# EAGLE design openmotestm (EAGLE 6.6.0)
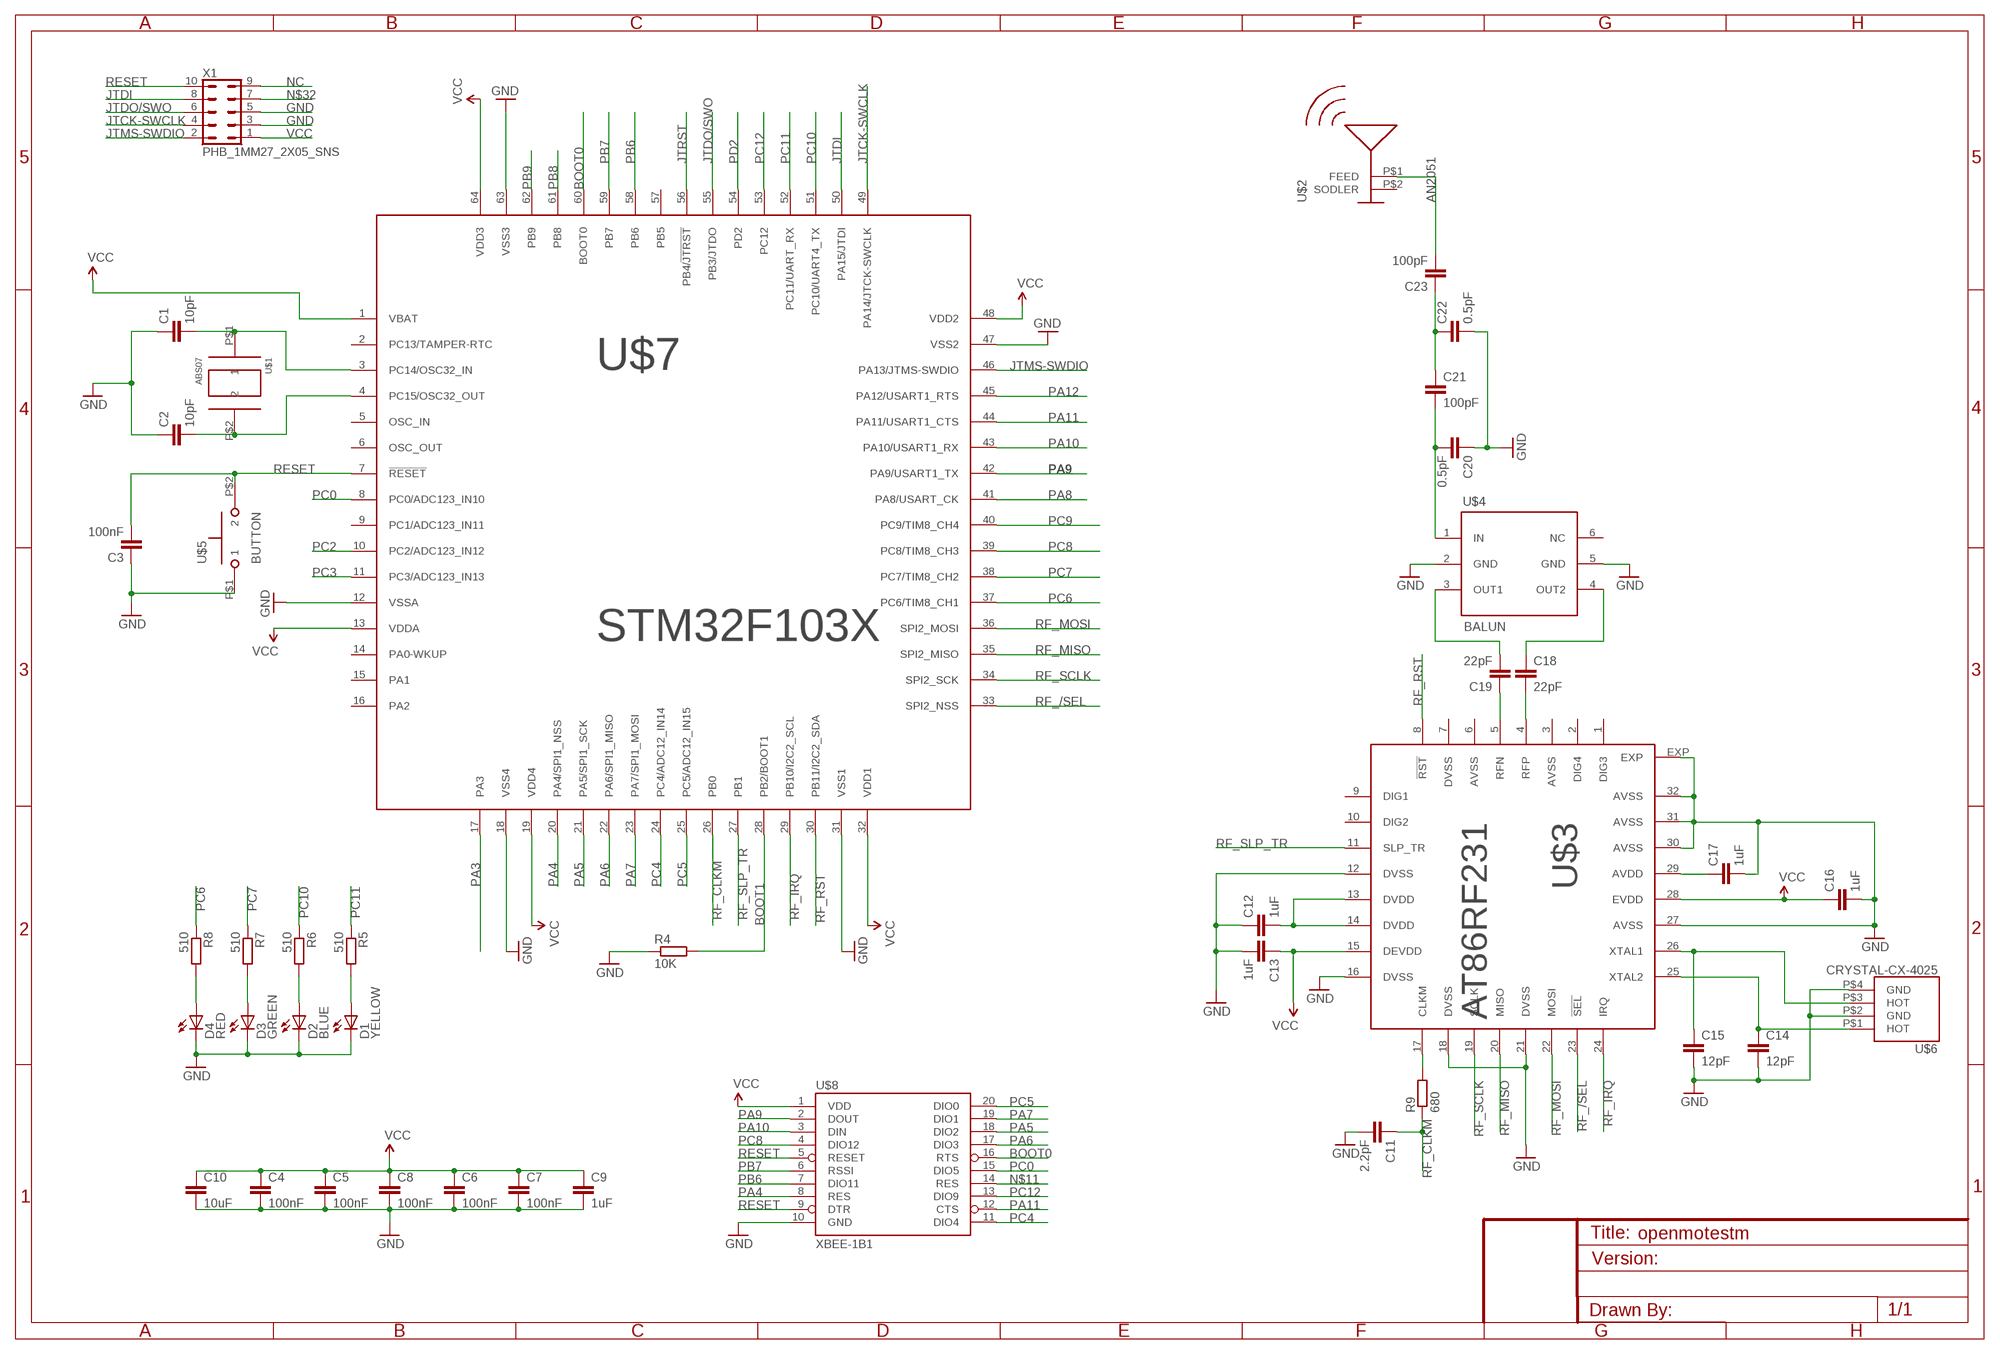
[diagram p0: schematic, sheet 1]

## Parts
C1  10pF  C-EUC0402  [C0402]
C2  10pF  C-EUC0402  [C0402]
C3  100nF  C-EUC0402  [C0402]
C4  100nF  C-EUC0402  [C0402]
C5  100nF  C-EUC0402  [C0402]
C6  100nF  C-EUC0402  [C0402]
C7  100nF  C-EUC0402  [C0402]
C8  100nF  C-EUC0402  [C0402]
C9  1uF  C-EUC0603  [C0603]
C10  10uF  C-EUC0603  [C0603]
C11  2.2pF  C-EUC0402  [C0402]
C12  1uF  C-EUC0603  [C0603]
C13  1uF  C-EUC0603  [C0603]
C14  12pF  C-EUC0402  [C0402]
C15  12pF  C-EUC0402  [C0402]
C16  1uF  C-EUC0603  [C0603]
C17  1uF  C-EUC0603  [C0603]
C18  22pF  C-EUC0402  [C0402]
C19  22pF  C-EUC0402  [C0402]
C20  0.5pF  C-EUC0402  [C0402]
C21  100pF  C-EUC0402  [C0402]
C22  0.5pF  C-EUC0402  [C0402]
C23  100pF  C-EUC0402  [C0402]
D1  YELLOW  LED-YELLOW0603  [LED-0603]
D2  BLUE  LED-BLUE0603  [LED-0603]
D3  GREEN  LED-GREEN0603  [LED-0603]
D4  RED  LED-RED0603  [LED-0603]
R4  10K  R-EU_R0402  [R0402]
R5  510  R-EU_R0402  [R0402]
R6  510  R-EU_R0402  [R0402]
R7  510  R-EU_R0402  [R0402]
R8  510  R-EU_R0402  [R0402]
R9  680  R-EU_R0402  [R0402]
U$1  ABS07  [ABS07]
U$2  AN2051  [AN2051]
U$3  AT86RF231  [QFN32]
U$4  BALUN  [BALUN]
U$5  BUTTON  [BUTTON]
U$6  CRYSTAL-CX-4025  [CX-4025]
U$7  STM32F103X  [LQFP-ST-64-2]
U$8  XBEE-1B1  [XBEE-1]
X1  PHB_1MM27_2X05_SNS  [PHB_1MM27_2X05_SNS]

## Nets
BOOT0: U$7.60(BOOT0) U$8.16(RTS)
BOOT1: R4.2 U$7.28(PB2/BOOT1)
GND: C1.1 C2.1 C3.1 C4.2 C5.2 C6.2 C7.2 C8.2 C9.2 C10.2 C11.2 C12.1 C13.2 C14.2 C15.2 C16.2 C17.2 C20.1 C22.2 D1.C D2.C D3.C D4.C R4.1 U$3.12(DVSS) U$3.16(DVSS) U$3.18(DVSS) U$3.21(DVSS) U$3.27(AVSS) U$3.30(AVSS) U$3.31(AVSS) U$3.32(AVSS) U$3.EXP U$4.2(GND) U$4.5(GND) U$5.P$1 U$6.P$2(GND) U$6.P$4(GND) U$7.12(VSSA) U$7.18(VSS4) U$7.31(VSS1) U$7.47(VSS2) U$7.63(VSS3) U$8.10(GND) X1.3 X1.5
JTCK-SWCLK: U$7.49(PA14/JTCK-SWCLK) X1.4
JTDI: U$7.50(PA15/JTDI) X1.8
JTDO/SWO: U$7.55(PB3/JTDO) X1.6
JTMS-SWDIO: U$7.46(PA13/JTMS-SWDIO) X1.2
JTRST: U$7.56(PB4/!JTRST)
N$1: C1.2 U$1.P$1 U$7.3(PC14/OSC32_IN)
N$2: C2.2 U$1.P$2 U$7.4(PC15/OSC32_OUT)
N$5: R9.2 U$3.17(CLKM)
N$7: C14.1 U$3.25(XTAL2) U$6.P$1(HOT)
N$8: D1.A R5.2
N$9: D2.A R6.2
N$11: U$8.14(RES)
N$12: D3.A R7.2
N$13: D4.A R8.2
N$14: C15.1 U$3.26(XTAL1) U$6.P$3(HOT)
N$15: C12.2 U$3.13(DVDD) U$3.14(DVDD)
N$16: C18.2 U$3.4(RFP)
N$17: C19.1 U$3.5(RFN)
N$18: C19.2 U$4.3(OUT1)
N$19: C17.1 U$3.29(AVDD)
N$21: C18.1 U$4.4(OUT2)
N$24: C20.2 C21.2 U$4.1(IN)
N$25: C21.1 C22.1 C23.1
N$27: C23.2 U$2.P$1(FEED)
N$32: X1.7
NC: X1.9
PA3: U$7.17(PA3)
PA4: U$7.20(PA4/SPI1_NSS) U$8.8(RES)
PA5: U$7.21(PA5/SPI1_SCK) U$8.18(DIO2)
PA6: U$7.22(PA6/SPI1_MISO) U$8.17(DIO3)
PA7: U$7.23(PA7/SPI1_MOSI) U$8.19(DIO1)
PA8: U$7.41(PA8/USART_CK)
PA9: U$7.42(PA9/USART1_TX) U$8.2(DOUT)
PA10: U$7.43(PA10/USART1_RX) U$8.3(DIN)
PA11: U$7.44(PA11/USART1_CTS) U$8.12(CTS)
PA12: U$7.45(PA12/USART1_RTS)
PB6: U$7.58(PB6) U$8.7(DIO11)
PB7: U$7.59(PB7) U$8.6(RSSI)
PB8: U$7.61(PB8)
PB9: U$7.62(PB9)
PC0: U$7.8(PC0/ADC123_IN10) U$8.15(DIO5)
PC2: U$7.10(PC2/ADC123_IN12)
PC3: U$7.11(PC3/ADC123_IN13)
PC4: U$7.24(PC4/ADC12_IN14) U$8.11(DIO4)
PC5: U$7.25(PC5/ADC12_IN15) U$8.20(DIO0)
PC6: R8.1 U$7.37(PC6/TIM8_CH1)
PC7: R7.1 U$7.38(PC7/TIM8_CH2)
PC8: U$7.39(PC8/TIM8_CH3) U$8.4(DIO12)
PC9: U$7.40(PC9/TIM8_CH4)
PC10: R6.1 U$7.51(PC10/UART4_TX)
PC11: R5.1 U$7.52(PC11/UART_RX)
PC12: U$7.53(PC12) U$8.13(DIO9)
PD2: U$7.54(PD2)
RESET: C3.2 U$5.P$2 U$7.7(!RESET) U$8.5(RESET) U$8.9(DTR) X1.10
RF_/SEL: U$3.23(!SEL) U$7.33(SPI2_NSS)
RF_CLKM: C11.1 R9.1 U$7.26(PB0)
RF_IRQ: U$3.24(IRQ) U$7.29(PB10/I2C2_SCL)
RF_MISO: U$3.20(MISO) U$7.35(SPI2_MISO)
RF_MOSI: U$3.22(MOSI) U$7.36(SPI2_MOSI)
RF_RST: U$3.8(!RST) U$7.30(PB11/I2C2_SDA)
RF_SCLK: U$3.19(SCLK) U$7.34(SPI2_SCK)
RF_SLP_TR: U$3.11(SLP_TR) U$7.27(PB1)
VCC: C4.1 C5.1 C6.1 C7.1 C8.1 C9.1 C10.1 C13.1 C16.1 U$3.15(DEVDD) U$3.28(EVDD) U$7.1(VBAT) U$7.13(VDDA) U$7.19(VDD4) U$7.32(VDD1) U$7.48(VDD2) U$7.64(VDD3) U$8.1(VDD) X1.1
Unconnected: U$2.P$2(SODLER) U$3.1(DIG3) U$3.2(DIG4) U$3.3(AVSS) U$3.6(AVSS) U$3.7(DVSS) U$3.9(DIG1) U$3.10(DIG2) U$4.6(NC) U$7.2(PC13/TAMPER-RTC) U$7.5(OSC_IN) U$7.6(OSC_OUT) U$7.9(PC1/ADC123_IN11) U$7.14(PA0-WKUP) U$7.15(PA1) U$7.16(PA2) U$7.57(PB5)

## Library data of the parts
C1 C2 = resistor:C-EU: CAPACITOR, European symbol
C3-C23 = rcl:C-EU: CAPACITOR, European symbol
D1 = SparkFun-LED:LED-YELLOW: Yellow SMD LEDs LilyPad 1206- DIO-09909 0603- DIO-09003; PROD_ID: DIO-09003
D2 = SparkFun-LED:LED-BLUE: Blue LEDs for production use Various blue LEDs stocked by SparkFun production 0603 - DIO-08575 Rebel - DIO-09553 1206 - DIO-09911; PROD_ID: DIO-08575
D3 = SparkFun-LED:LED-GREEN: Various green LEDs Green LEDs used in SFE Production 0603- DIO-00821 LARGE- DIO-00862 LILYPAD- DIO-09910; PROD_ID: DIO-00821
D4 = SparkFun-LED:LED-RED: Assorted Red LEDs LilyPad 1206- DIO-09912 1206- DIO-00809 0603- DIO-00819; PROD_ID: DIO-00819
R4-R9 = rcl:R-EU_: RESISTOR, European symbol
U$1 = openmotestm:ABS07: ABS07 32.768kHz SMD LOW PROFILE CRYSTAL
U$2 = openmotestm:AN2051: AN2051 Multilayer Chip Antenna
U$3 = openmotestm:AT86RF231: AT86RF231
U$4 = openmotestm:BALUN: Chip-Balun WE-BAL
U$5 = openmotestm:BUTTON: TL1015AF160QG http://spec_sheets.e-switch.com/specs/P420000.pdf
U$6 = openmotestm:CRYSTAL-CX-4025: CX-4025S datasheet:http://www.datasheetarchive.com/dlmain/Datasheets-16/DSA-312893.pdf
U$7 = openmotestm:STM32F103X: STM32F103xC and STM32F103xE performance line LQFP64 pinout
U$8 = openmotestm:XBEE-1: Xbee module footprints SMT header is CONN-09042.
X1 = _hhn_con_pinhead_box_1mm27:PHB_1MM27_2X05_*: Pin Header Box-Type, 1.27mm/0.5"/50mil Pitch, 2x05 Circuits Note: see library description for an important note about THT-version

## Board
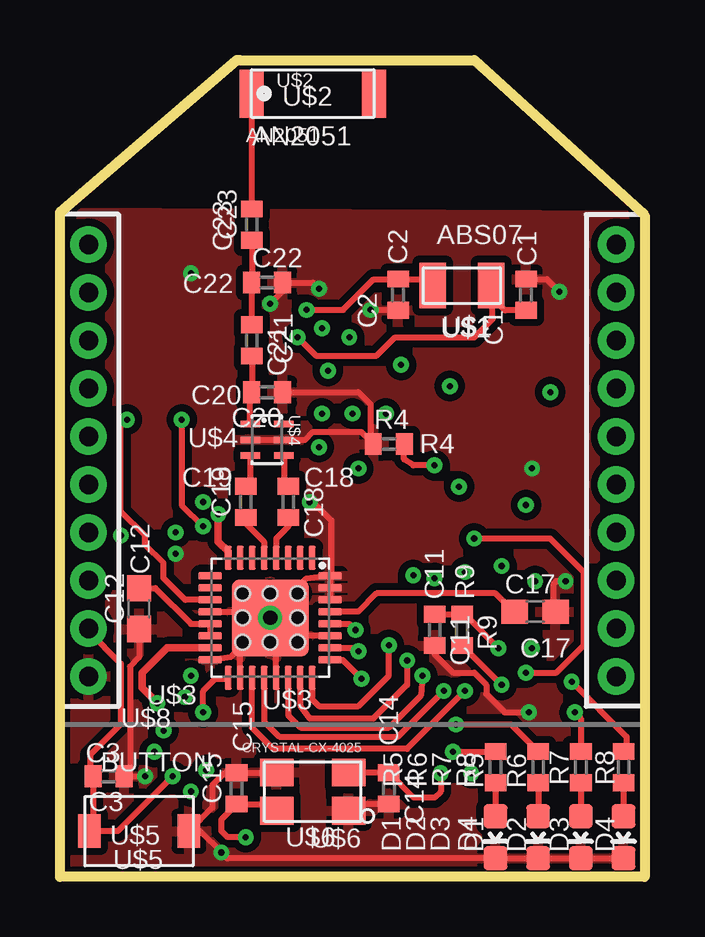
[diagram p1: board, top side]
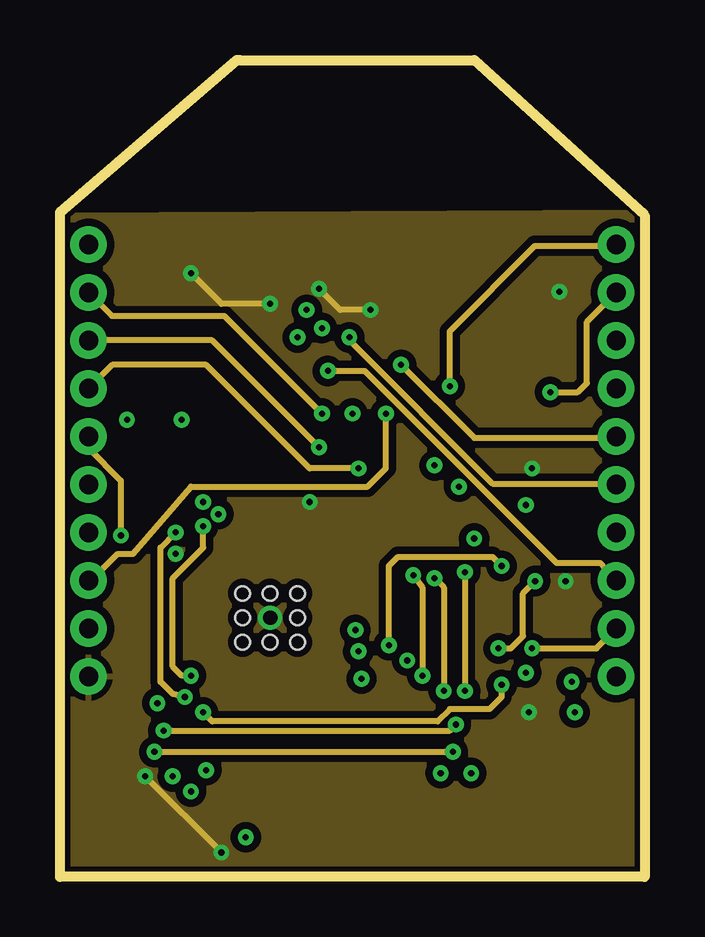
[diagram p2: board, inner layer Route2]
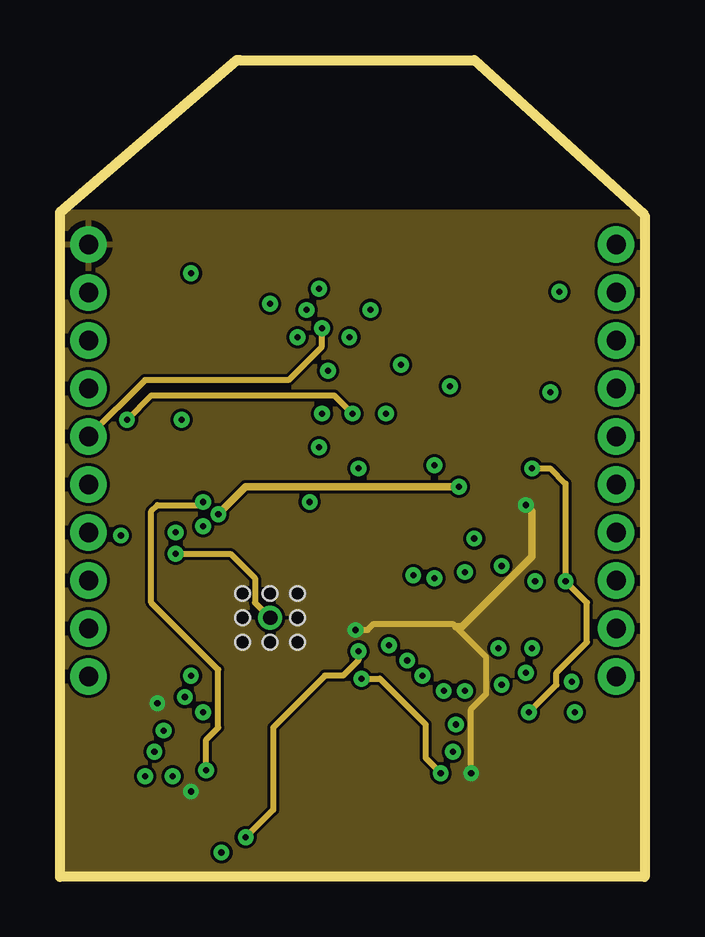
[diagram p3: board, inner layer Route15]
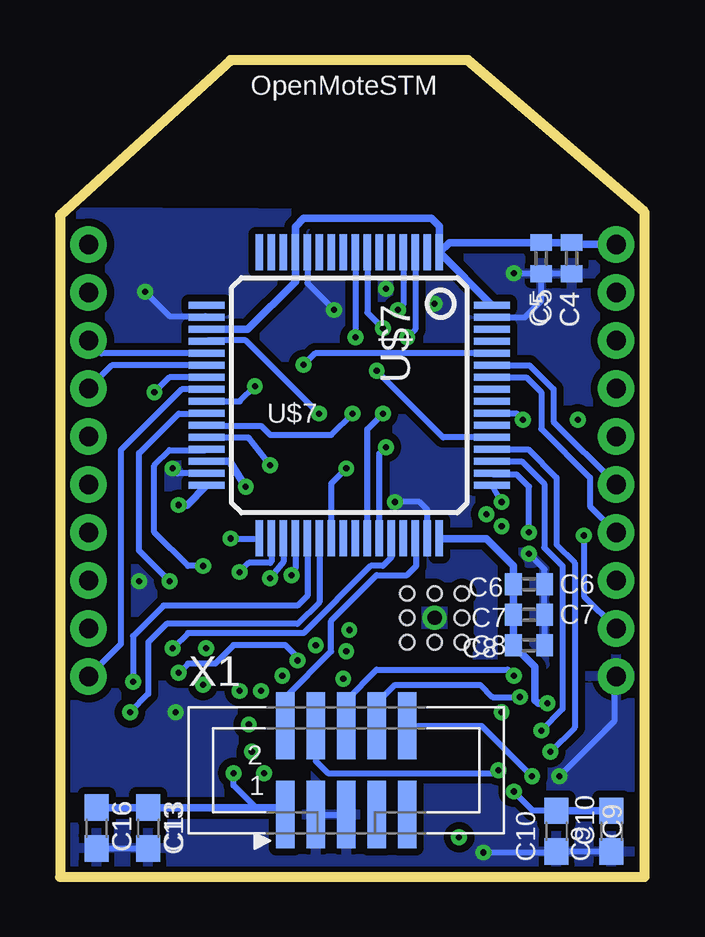
[diagram p4: board, bottom side, seen from below]

Size 24.38 x 34.04 mm. Coordinates in mm from the lower left corner, seen from the top.
Outline: 0,0 0,27.69 7.37,34.04 17.27,34.04 24.38,27.69 24.38,0 0,0
Copper layers (1*2*15*16): Top 0.035mm / dielectric 1.5mm / Route2 0.035mm / dielectric 0.15mm / Route15 0.035mm / dielectric 0.2mm / Bottom 0.035mm
Design rules "default *": minimum track width 10mil, minimum drill 5mil, track to track 5mil, track to pad 5mil, pad to pad 5mil, via to via 5mil, smd to smd 5mil, copper to edge 1mil, drill to drill 1mil, minimum pad ring 10mil, minimum via ring 8mil, stop-mask expansion 4mil, vias tented up to drill 0mil, thermal gap 10mil
Holes 0.6 mm at 7.62,11.81 8.76,11.81 9.91,11.81 7.62,10.79 9.91,10.79 7.62,9.78 8.76,9.78 9.91,9.78
Milling: 6 lines

### Footprints (pad centres in the part's own frame; a part is rotated, then mirrored left to right if it is on the bottom)
C0402 = smd 0.7 x 0.9: 1 -0.65,0; 2 0.65,0
C0603 = smd 1.1 x 1: 1 -0.85,0; 2 0.85,0
LED-0603 = smd 1 x 1: A 0,-0.877; C 0,0.877
R0402 = smd 0.7 x 0.9: 1 -0.65,0; 2 0.65,0
ABS07 = smd 1.092 x 1.905: P$1 -1.219,0; P$2 1.219,0
AN2051 = smd 1 x 2: P$1 -2.55,0; P$2 2.55,0
QFN32 = smd 1 x 0.3: 1 -2.5,1.75; 2 -2.5,1.25; 3 -2.5,0.75; 4 -2.5,0.25; 5 -2.5,-0.25; 6 -2.5,-0.75; 7 -2.5,-1.25; 8 -2.5,-1.75; 17 2.5,-1.75; 18 2.5,-1.25; 19 2.5,-0.75; 20 2.5,-0.25; 21 2.5,0.25; 22 2.5,0.75; 23 2.5,1.25; 24 2.5,1.75 | smd 0.3 x 1: 9 -1.75,-2.5; 10 -1.25,-2.5; 11 -0.75,-2.5; 12 -0.25,-2.5; 13 0.25,-2.5; 14 0.75,-2.5; 15 1.25,-2.5; 16 1.75,-2.5; 25 1.75,2.5; 26 1.25,2.5; 27 0.75,2.5; 28 0.25,2.5; 29 -0.25,2.5; 30 -0.75,2.5; 31 -1.25,2.5; 32 -1.75,2.5 | smd 3.2 x 3.2: EXP 0,0
BALUN = smd 0.27 x 0.8: 1 -0.7,-0.7; 2 -0.05,-0.7; 3 0.6,-0.7; 4 0.6,0.7; 5 -0.05,0.7; 6 -0.7,0.7
BUTTON = smd 0.95 x 1.4: P$1 -2.075,0; P$2 2.075,0
CX-4025 = smd 1.4 x 1.15: P$1 -1.5,-0.8; P$2 1.5,-0.8; P$3 1.5,0.8; P$4 -1.5,0.8
LQFP-ST-64-2 = smd 1.5 x 0.3: 1 -5.95,3.75; 2 -5.95,3.25; 3 -5.95,2.75; 4 -5.95,2.25; 5 -5.95,1.75; 6 -5.95,1.25; 7 -5.95,0.75; 8 -5.95,0.25; 9 -5.95,-0.25; 10 -5.95,-0.75; 11 -5.95,-1.25; 12 -5.95,-1.75; 13 -5.95,-2.25; 14 -5.95,-2.75; 15 -5.95,-3.25; 16 -5.95,-3.75; 33 5.95,-3.75; 34 5.95,-3.25; 35 5.95,-2.75; 36 5.95,-2.25; 37 5.95,-1.75; 38 5.95,-1.25; 39 5.95,-0.75; 40 5.95,-0.25; 41 5.95,0.25; 42 5.95,0.75; 43 5.95,1.25; 44 5.95,1.75; 45 5.95,2.25; 46 5.95,2.75; 47 5.95,3.25; 48 5.95,3.75 | smd 0.3 x 1.5: 17 -3.75,-5.95; 18 -3.25,-5.95; 19 -2.75,-5.95; 20 -2.25,-5.95; 21 -1.75,-5.95; 22 -1.25,-5.95; 23 -0.75,-5.95; 24 -0.25,-5.95; 25 0.25,-5.95; 26 0.75,-5.95; 27 1.25,-5.95; 28 1.75,-5.95; 29 2.25,-5.95; 30 2.75,-5.95; 31 3.25,-5.95; 32 3.75,-5.95; 49 3.75,5.95; 50 3.25,5.95; 51 2.75,5.95; 52 2.25,5.95; 53 1.75,5.95; 54 1.25,5.95; 55 0.75,5.95; 56 0.25,5.95; 57 -0.25,5.95; 58 -0.75,5.95; 59 -1.25,5.95; 60 -1.75,5.95; 61 -2.25,5.95; 62 -2.75,5.95; 63 -3.25,5.95; 64 -3.75,5.95
XBEE-1 = drill 0.8 pad 1.524: 1 -11,20; 2 -11,18; 3 -11,16; 4 -11,14; 5 -11,12; 6 -11,10; 7 -11,8; 8 -11,6; 9 -11,4; 10 -11,2; 11 11,2; 12 11,4; 13 11,6; 14 11,8; 15 11,10; 16 11,12; 17 11,14; 18 11,16; 19 11,18; 20 11,20
PHB_1MM27_2X05_SNS = smd 0.76 x 2.8: 1 -2.54,-1.85; 2 -2.54,1.85; 3 -1.27,-1.85; 4 -1.27,1.85; 5 0,-1.85; 6 0,1.85; 7 1.27,-1.85; 8 1.27,1.85; 9 2.54,-1.85; 10 2.54,1.85

### Placement (x,y rotation side)
C1  19.43,24.26 270 top
C2  14.1,24.26 90 top
C3  2.03,4.19 180 top
C4  3.05,25.78 270 bottom
C5  4.32,25.78 270 bottom
C6  4.83,12.19 0 bottom
C7  4.83,10.92 0 bottom
C8  4.83,9.65 0 bottom
C9  3.68,1.9 270 bottom
C10  1.4,1.9 270 bottom
C11  15.62,10.29 270 top
C12  3.3,11.18 90 top
C13  20.7,2.03 270 bottom
C14  13.72,3.68 270 top
C15  7.37,3.68 90 top
C16  22.86,2.03 270 bottom
C17  19.81,11.05 0 top
C18  9.52,15.62 270 top
C19  7.75,15.62 90 top
C20  8.64,20.19 180 top
C21  8,22.35 270 top
C22  8.64,24.77 0 top
C23  8,27.18 90 top
D1  18.16,1.65 180 top
D2  19.94,1.65 180 top
D3  21.72,1.65 180 top
D4  23.49,1.65 180 top
R4  13.72,18.03 0 top
R5  18.16,4.57 270 top
R6  19.94,4.57 270 top
R7  21.72,4.57 270 top
R8  23.49,4.57 270 top
R9  16.76,10.29 270 top
U$1  16.76,24.64 180 top
U$2  10.54,32.64 0 top
U$3  8.76,10.79 270 top
U$4  8.64,18.16 270 top
U$5  3.3,1.9 180 top
U$6  10.54,3.56 180 top
U$7  12.32,20.07 270 bottom
U$8  12.19,6.35 0 top
X1  12.45,4.44 0 bottom

### Tracks (layer width: path | path; a pad name or v marks a point on that pad's centre or on a via)
BOOT0  (via drill 0.25 pad 0.41)
  Route2 0.254: v14.22,21.34 17.27,18.29 23.13,18.29 U$8.16
  Bottom 0.254: U$7.60 13.74,21.82 v14.22,21.34
BOOT1  (via drill 0.25 pad 0.41)
  Top 0.254: v15.62,17.14 14.73,17.14 14.35,17.4 14.35,18.02 R4.2
  Bottom 0.254: U$7.28 16.54,18.32 v15.62,17.14
GND  (via drill 0.25 pad 0.41, 0.6 pad 0.25)
  Top 0.254: D4.C D3.C D2.C D1.C 6.97,0.77 v6.73,1.02 5.84,1.9 U$5.P$1 6.35,2.88 6.35,3.81 6.87,4.33 C15.2 9.02,4.33 U$6.P$2 | U$3.12 8.51,11.04 U$3.EXP | U$3.18 7.51,9.54 U$3.EXP | U$3.16 7.14,9.17 U$3.EXP | U$3.21 9.01,10.54 U$3.EXP | U$3.27 9.51,10.04 U$3.EXP | v10.79,24.51 10.54,24.77 C22.2 9.29,24.4 v8.76,23.88 | C2.1 12.97,23.61 v12.95,23.62 | C1.1 20.3,24.91 v20.83,24.38 | C20.1 12.45,20.19 12.95,19.69 12.95,18.15 R4.1 12.56,18.54 10.54,18.54 10.21,18.21 U$4.5 U$4.2 | U$3.32 10.26,12.42 U$3.EXP | U$3.32 U$3.31 U$3.30 | C11.2 15.62,9.27 16.38,8.51 17.27,8.51 17.78,8 17.78,7.62 18.54,6.86 v19.56,6.86 | v21.08,12.32 20.7,12.32 20.57,12.19 20.57,11.14 C17.2 | v3.56,4.19 C3.1 2.92,4.43 2.92,8.76 3.3,9.14 C12.1 | v10.41,15.62 10.54,15.62 11.3,14.86 11.3,12.58 U$3.32 | C14.2 12.32,3.03 U$6.P$4
  Route2 0.254: v12.95,23.62 11.68,23.62 v10.79,24.51 | v3.56,4.19 v6.73,1.02 | v8.76,23.88 6.73,23.88 v5.46,25.15
  Route15 0.254: v19.56,6.86 20.7,8 20.7,8.51 21.97,9.78 21.97,11.43 v21.08,12.32 21.08,16.38 20.45,17.02 v19.68,17.02 | v4.83,13.46 7.11,13.46 8.13,12.45 8.13,11.43 U$3.EXP
  Bottom 0.254: X1.3 X1.5 | C16.2 C13.2 | C10.2 C9.2 3.72,1.02 v6.73,1.02 | C4.2 C5.2 | U$7.63 5,23.32 4.32,24 C5.2 | v20.83,24.38 19.81,23.37 18.32,23.37 U$7.18 | U$7.12 14.07,24.74 v12.95,23.62 | v5.46,25.15 4.33,25.15 C5.2 | U$7.31 19.48,16.82 v19.68,17.02 | C8.2 C7.2 C6.2 4.18,12.81 v4.83,13.46 | U$8.10 1.19,7.7 1.27,7.62 1.27,6.48 v3.56,4.19 | U$7.47 9.07,15.29 9.4,15.62 v10.41,15.62
  other vias: 8.76,10.79
  pour Bottom (isolate 0.305): 0.13,27.56 24.13,27.69 24.13,0.25 0.13,0.25
  pour Top (isolate 0.305): 0.25,27.69 24,27.56 24.13,0.25 0.13,0.13
  pour Route2 (isolate 0.305): 0.13,27.56 24.13,27.69 24.26,0.13 0.13,0.13
JTCK-SWCLK  (via drill 0.25)
  Route15 0.254: v6.1,4.44 6.1,5.71 6.6,6.22 6.6,8.64 3.81,11.43 3.81,15.24 4.06,15.49 5.84,15.49 v5.97,15.62
  Bottom 0.254: X1.4 13.72,4.83 13.21,4.32 6.22,4.32 v6.1,4.44 | v5.97,15.62 U$7.49
JTDI  (via drill 0.25 pad 0.41)
  Route2 0.254: v5.21,7.49 4.7,7.62 4.19,8.13 4.19,13.72 v4.83,14.35
  Bottom 0.254: X1.8 11.18,7.24 10.41,8 6.86,8 6.35,7.49 v5.21,7.49 | v4.83,14.35 4.83,16.26 5.33,16.76 6.32,16.76 U$7.50
JTDO/SWO  (via drill 0.25 pad 0.41)
  Top 0.254: v5.08,19.05 5.08,15.49 v5.97,14.61
  Route2 0.254: v5.46,8.38 5.08,8.38 4.7,8.76 4.7,12.45 5.97,13.72 v5.97,14.61
  Bottom 0.254: X1.6 12.45,7.37 11.18,8.64 5.71,8.64 v5.46,8.38 | U$7.55 5.35,19.32 v5.08,19.05
JTMS-SWDIO
  Bottom 0.254: X1.2 14.99,7.49 13.08,9.4 13.08,10.67 11.18,12.57 9.91,12.57 9.52,12.95 9.52,14.07 U$7.46
N$1  (via drill 0.25 pad 0.41)
  Top 0.254: v9.91,22.48 10.67,21.72 13.21,21.72 13.97,22.48 17.27,22.48 18.03,23.24 18.03,24.13 | 18.03,24.13 18.03,24.59 U$1.P$1 | C1.2 18.56,23.61 18.03,24.13
  Bottom 0.254: U$7.3 9.57,22.82 v9.91,22.48
N$2  (via drill 0.25 pad 0.41)
  Top 0.254: U$1.P$2 15.28,24.91 C2.2 14.08,24.89 13.08,24.89 11.81,23.62 v10.29,23.62
  Bottom 0.254: U$7.4 10.07,23.84 v10.29,23.62
N$5  (via drill 0.25 pad 0.41)
  Top 0.254: R9.2 16.78,9.64 v18.41,8 | v5.97,6.86 5.97,7.75 6.48,8.25 6.97,8.25 U$3.17
  Route2 0.254: v18.41,8 18.41,7.49 17.91,6.98 16.26,6.98 15.75,6.48 6.35,6.48 v5.97,6.86
N$7  (via drill 0.25)
  Top 0.254: U$6.P$1 12.06,4.33 C14.1 14.75,3.3 15.62,3.3 15.88,3.56 v15.88,4.32 | U$3.25 11.78,9.04 v12.57,8.25
  Route15 0.254: v12.57,8.25 13.34,8.25 15.24,6.35 15.24,4.95 v15.88,4.32
N$8
  Top 0.254: R5.2 D1.A
N$9
  Top 0.254: R6.2 D2.A
N$12
  Top 0.254: R7.2 D3.A
N$13
  Top 0.254: R8.2 D4.A
N$14  (via drill 0.25)
  Top 0.254: U$6.P$3 8.76,3.03 C15.1 6.73,2.4 6.73,1.9 6.98,1.65 v7.75,1.65 | U$3.26 12.3,9.54 v12.45,9.4
  Route15 0.254: v12.45,9.4 12.45,9.02 11.81,8.38 11.05,8.38 8.89,6.22 8.89,2.79 v7.75,1.65
N$15
  Top 0.254: U$3.14 U$3.13 5.46,10.54 3.98,12.03 C12.2
N$16
  Top 0.254: C18.2 9.52,14.61 9.02,14.1 U$3.4
N$17
  Top 0.254: C19.1 7.75,14.73 8.51,13.97 U$3.5
N$18
  Top 0.254: U$4.3 7.94,16.46 C19.2
N$19
  Top 0.254: C17.1 18.92,11.05 18.16,11.81 13.21,11.81 12.45,11.05 U$3.29
N$21
  Top 0.254: U$4.4 9.34,16.46 C18.1
N$24
  Top 0.254: C21.2 8,20.21 C20.2 7.94,20.14 U$4.1
N$25
  Top 0.254: C23.1 C22.1 7.99,23.02 C21.1
N$27
  Top 0.254: U$2.P$1 C23.2
PA4  (via drill 0.25 pad 0.41)
  Route2 0.254: U$8.8 1.3,12.35 2.41,13.46 3.05,13.46 5.46,16.26 12.83,16.26 13.59,17.02 v13.59,19.3
  Bottom 0.254: v13.59,19.3 16.64,22.35 18.23,22.35 U$7.20
PA5
  Bottom 0.254: U$7.21 22.66,21.82 U$8.18
PA6
  Bottom 0.254: U$7.22 22.23,21.32 U$8.17
PA7  (via drill 0.25 pad 0.41)
  Route2 0.254: v20.45,20.19 21.59,20.19 21.97,20.57 21.97,23.13 U$8.19
  Bottom 0.254: U$7.23 19.82,20.82 v20.45,20.19
PA9  (via drill 0.25 pad 0.41)
  Route2 0.254: v10.92,19.3 6.86,23.37 2.17,23.37 U$8.2
  Bottom 0.254: U$7.42 11.57,18.66 v10.92,19.3
PA10  (via drill 0.25 pad 0.41)
  Route2 0.254: v10.79,17.91 6.35,22.35 U$8.3
  Bottom 0.254: U$7.43 11.07,17.63 v10.79,17.91
PA11  (via drill 0.25 pad 0.41)
  Route2 0.254: v19.68,9.53 22.37,9.53 U$8.12
  Bottom 0.254: U$7.44 10.57,13.31 10.92,12.95 11.43,12.95 14.22,10.16 19.05,10.16 v19.68,9.53
PB6
  Bottom 0.254: U$7.58 4.94,20.82 4.32,20.19 4.32,18.67 2.29,16.64 2.29,15.44 U$8.7
PB7
  Bottom 0.254: U$7.59 4.81,21.32 3.81,20.32 3.81,18.97 U$8.6
PC0  (via drill 0.25 pad 0.41)
  Route2 0.254: v12.06,22.48 12.06,22.35 18.03,16.38 23.16,16.38 U$8.15
  Bottom 0.254: U$7.8 v12.07,22.48 v12.06,22.48
PC4
  Bottom 0.254: U$7.24 19.31,20.32 21.84,17.78 21.84,9.7 U$8.11
PC5  (via drill 0.25 pad 0.41)
  Route2 0.254: v16.26,20.45 16.26,22.73 19.81,26.29 23.13,26.29 U$8.20
  Bottom 0.254: U$7.25 16.89,19.82 v16.26,20.45
PC6  (via drill 0.25 pad 0.41)
  Top 0.254: v21.34,8.13 23.62,5.84 23.62,5.35 R8.1
  Bottom 0.254: U$7.37 14.07,11.71 14.48,11.3 20.07,11.3 21.34,10.03 v21.34,8.13
PC7  (via drill 0.25 pad 0.41)
  Top 0.254: v21.46,6.86 21.72,6.6 R7.1
  Bottom 0.254: U$7.38 13.57,11.45 14.48,10.54 19.94,10.54 20.7,9.78 20.7,7.62 v21.46,6.86
PC8  (via drill 0.25 pad 0.41)
  Route2 0.254: v12.45,17.02 10.41,17.02 6.1,21.34 2.18,21.34 U$8.4
  Bottom 0.254: U$7.39 13.07,16.39 v12.45,17.02
PC10  (via drill 0.25 pad 0.41)
  Top 0.254: v16.51,6.35 18.81,6.35 R6.1
  Route2 0.254: v4.32,6.1 16.26,6.1 v16.51,6.35
  Bottom 0.254: U$7.51 5.12,17.32 4.19,16.38 4.19,13.72 3.43,12.95 3.43,6.98 v4.32,6.1
PC11  (via drill 0.25 pad 0.41)
  Top 0.254: v16.38,5.21 18.15,5.21 R5.1
  Route2 0.254: v3.94,5.21 v16.38,5.21
  Bottom 0.254: U$7.52 4.86,17.82 3.68,16.64 3.68,13.84 2.92,13.08 2.92,6.22 v3.94,5.21
PC12  (via drill 0.25 pad 0.41)
  Route2 0.254: v11.18,21.08 12.7,21.08 20.7,13.08 22.53,13.08 U$8.13
  Bottom 0.254: U$7.53 8.41,18.32 v11.18,21.08
RESET  (via drill 0.25 pad 0.41)
  Top 0.254: U$8.9 1.19,10.24 2.54,8.89 2.54,6.35 1.27,5.08 1.27,4.3 C3.2 1.38,2.06 U$5.P$2 2.41,1.9 v4.7,4.19
  Route2 0.254: U$8.5 1.19,17.86 2.54,16.51 v2.54,14.22
  Route15 0.254: U$8.5 3.54,20.7 9.52,20.7 10.92,22.1 v10.92,22.86
  Bottom 0.254: U$7.7 11.57,23.51 v10.92,22.86 | v2.54,14.22 2.54,11.7 U$8.9 | X1.10 6.8,6.29 v4.7,4.19
RF_/SEL  (via drill 0.25 pad 0.41)
  Top 0.254: U$3.23 10.01,7.13 10.41,6.6 13.08,6.6 14.48,8 v14.48,9.02 | v19.43,8.51 20.7,8.51 21.84,9.65 21.84,12.7 20.45,14.1 v17.27,14.1 17.14,14.22
  Bottom 0.254: v19.43,8.51 19.05,8.89 17.91,8.89 17.14,9.65 14.99,9.65 14.48,9.14 v14.48,9.02 | v17.27,14.1 16.09,14.1 U$7.33
RF_CLKM  (via drill 0.25 pad 0.41)
  Top 0.254: C11.1 R9.1 16.88,10.94 v18.29,9.53
  Route2 0.254: v18.29,9.53 18.8,9.53 19.3,10.03 19.3,11.81 v19.81,12.32
  Bottom 0.254: v19.81,12.32 21.08,13.59 21.08,17.65 19.43,19.3 18.28,19.3 U$7.26
RF_IRQ  (via drill 0.25 pad 0.41)
  Top 0.254: U$3.24 10.51,7.39 10.79,7.11 12.45,7.11 13.72,8.38 v13.72,9.65
  Route2 0.254: v13.72,9.65 13.72,12.95 14.1,13.33 18.03,13.33 v18.41,12.95
  Bottom 0.254: v18.41,12.95 19.05,12.95 20.45,14.35 20.45,17.14 19.81,17.78 18.3,17.78 U$7.29
RF_MISO  (via drill 0.25 pad 0.41)
  Top 0.254: U$3.20 8.51,6.47 9.14,5.84 14.1,5.84 v16,7.75
  Route2 0.254: v15.62,12.45 16,12.06 v16,7.75
  Bottom 0.254: U$7.35 15.07,13.12 v15.62,12.45
RF_MOSI  (via drill 0.25 pad 0.41)
  Top 0.254: U$3.22 9.51,6.74 10.03,6.22 13.72,6.22 15.05,7.56 v15.11,8.38
  Route2 0.254: v14.73,12.57 15.11,12.06 v15.11,8.38
  Bottom 0.254: U$7.36 14.57,12.86 v14.73,12.57
RF_RST  (via drill 0.25 pad 0.41)
  Top 0.305: U$3.8 7.01,13.56 6.6,13.97 v6.6,15.11
  Route15 0.305: v16.64,16.26 7.75,16.26 v6.6,15.11
  Bottom 0.305: U$7.30 17.32,17.32 v16.64,16.26
RF_SCLK  (via drill 0.25 pad 0.41)
  Top 0.254: v16.89,7.75 14.48,5.33 8.89,5.33 8,6.22 8,8.28 U$3.19
  Route2 0.254: v16.89,12.7 v16.89,7.75
  Bottom 0.254: U$7.34 15.57,13.13 15.62,13.08 16.51,13.08 v16.89,12.7
RF_SLP_TR  (via drill 0.25 pad 0.41)
  Top 0.254: v2.79,19.05 2.54,18.8 2.54,15.24 3.56,14.22 3.56,13.84 4.32,13.08 4.32,12.45 5.22,11.54 U$3.11
  Route15 0.254: v2.79,19.05 3.81,20.07 11.43,20.07 v12.19,19.3
  Bottom 0.254: v12.19,19.3 13.08,18.41 15.62,18.41 16,18.8 18.25,18.8 U$7.27
VCC  (via drill 0.25 pad 0.41)
  Top 0.254: U$3.28 12.06,10.54 v12.32,10.29
  Top 0.305: U$3.15 4.46,9.54 3.43,8.51 3.43,7.87 v4.06,7.24
  Route15 0.254: v17.14,4.32 17.14,6.98 17.78,7.62 17.78,9.14 16.51,10.41 16.38,10.54 13.08,10.54 12.83,10.29 v12.32,10.29
  Route15 0.305: 16.51,10.41 16.76,10.41 19.68,13.33 19.68,15.24 v19.43,15.49
  Bottom 0.254: C9.1 4.66,2.75 v5.46,3.56 | 15.27,2.88 16.22,2.88 17.14,3.81 v17.14,4.32
  Bottom 0.305: U$8.1 2.97,26.35 C4.1 C5.1 8.15,26.43 U$7.1 | U$7.1 U$7.64 | U$7.1 8.57,27.11 8.89,27.43 14.22,27.43 14.57,27.09 U$7.13 14.57,24.8 16.55,22.82 U$7.19 | C16.1 C13.1 15.27,2.88 X1.1 | C10.1 C9.1 | U$7.48 8.55,14.1 6.6,14.1 5.48,12.97 C6.1 C7.1 C8.1 4.57,8.75 4.57,7.37 4.45,7.24 v4.06,7.24 | v19.43,15.49 19.09,15.49 U$7.32
  pour Route15: 0.13,27.69 24.13,27.69 arc-90 24.38,27.43 24.13,0.25 0.13,0.25

### Text on the board
tPlace: U$2 | AN2051 | C23 | C1 | C22 | C2 | C21 | U$1 | C20 | U$4 | R4 | C19 | C18 | C12 | C11 | R9 | C17 | U$3 | C3 | C15 | C14 | R5 | R6 | R7 | R8 | U$5 | U$6 | D1 | D2 | D3 | D4
bPlace: OpenMoteSTM | C4 | C5 | U$7 | C6 | C7 | C8 | C13 | C16 | C9 | C10